# Altium schematic sheet in_buf.SchDoc
size A4
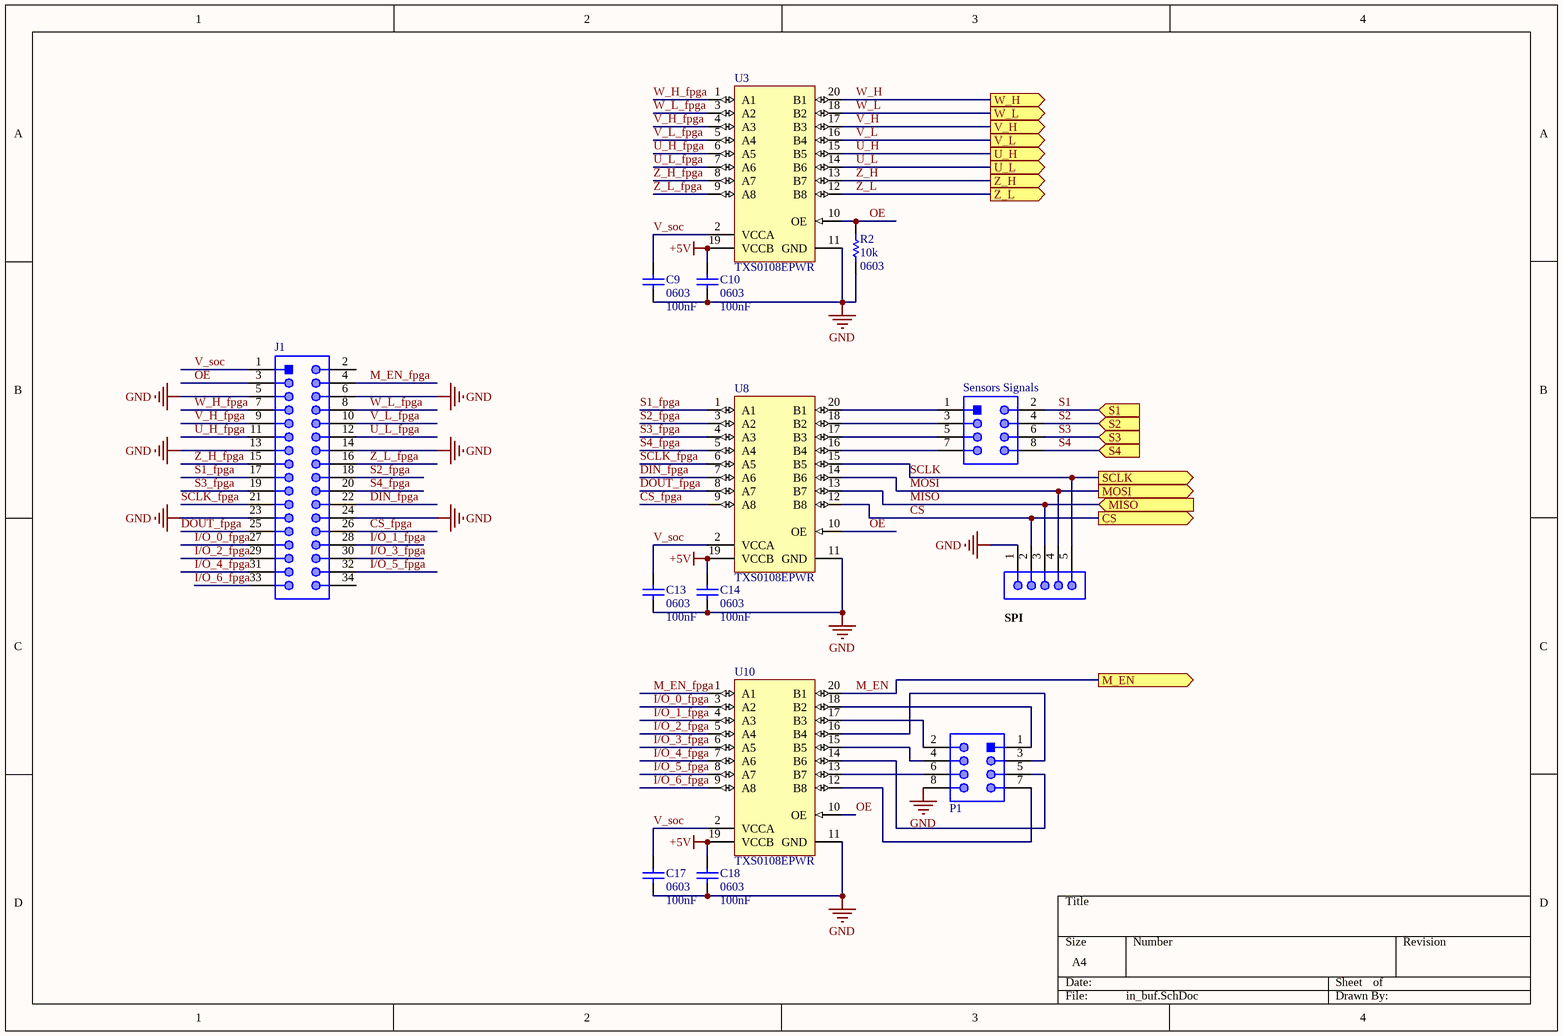
[diagram p0: in_buf.SchDoc]

## Parts
C9  Case Code (Imperial): 0603  Capacitance: 100nF  [CAPC1608X90X35ML10T15]  (hidden comment: GRM188R71H104KA93D)
C10  Case Code (Imperial): 0603  Capacitance: 100nF  [CAPC1608X90X35ML10T15]  (hidden comment: GRM188R71H104KA93D)
C13  Case Code (Imperial): 0603  Capacitance: 100nF  [CAPC1608X90X35ML10T15]  (hidden comment: GRM188R71H104KA93D)
C14  Case Code (Imperial): 0603  Capacitance: 100nF  [CAPC1608X90X35ML10T15]  (hidden comment: GRM188R71H104KA93D)
C17  Case Code (Imperial): 0603  Capacitance: 100nF  [CAPC1608X90X35ML10T15]  (hidden comment: GRM188R71H104KA93D)
C18  Case Code (Imperial): 0603  Capacitance: 100nF  [CAPC1608X90X35ML10T15]  (hidden comment: GRM188R71H104KA93D)
J1  61303421121  [61303421121]  (value not drawn)
P1  61300821121  [61300821121]  (value not drawn)
R2  Resistance (Ohms): 10k  Package Reference: 0603  [RESC1608X55X30ML15T20]  (hidden comment: RMCF0603FT10K0)
Sensors_Signals  61300821121  [61300821121]  (value not drawn)
SPI  PH2541-5-SPGRH-6-3  [PH2541-5-SPGRH-6-3_V]  (value not drawn)
U3  TXS0108EPWR  [PW0020A_M]
U8  TXS0108EPWR  [PW0020A_M]
U10  TXS0108EPWR  [PW0020A_M]

## Ports
CS (out), M_EN (out), MISO (in), MOSI (out), S1 (in), S2 (in), S3 (in), S4 (in), SCLK (out), U_H (out), U_L (out), V_H (out), V_L (out), W_H (out), W_L (out), Z_H (out), Z_L (out)

## Nets
+5V: C10.2 C14.2 C18.2 U3.19(VCCB) U8.19(VCCB) U10.19(VCCB)
GND: C9.1 C10.1 C13.1 C14.1 C17.1 C18.1 J1.5 J1.6 J1.13 J1.14 J1.23 J1.24 P1.8 R2.1 SPI.1 U3.11(GND) U8.11(GND) U10.11(GND)
CS: SPI.2 U8.12(B8) ; port CS
CS_fpga: J1.26 U8.9(A8)
DIN_fpga: J1.22 U8.7(A6)
DOUT_fpga: J1.25 U8.8(A7)
I/O_0_fpga: J1.27 U10.3(A2)
I/O_1_fpga: J1.28 U10.4(A3)
I/O_2_fpga: J1.29 U10.5(A4)
I/O_3_fpga: J1.30 U10.6(A5)
I/O_4_fpga: J1.31 U10.7(A6)
I/O_5_fpga: J1.32 U10.8(A7)
I/O_6_fpga: J1.33 U10.9(A8)
M_EN: U10.20(B1) ; port M_EN
M_EN_fpga: J1.4 U10.1(A1)
MISO: SPI.3 U8.13(B7) ; port MISO
MOSI: SPI.4 U8.14(B6) ; port MOSI
OE: J1.3 R2.2 U3.10(OE) U8.10(OE) U10.10(OE)
S1: Sensors_Signals.2 ; port S1
S1_fpga: J1.17 U8.1(A1)
S2: Sensors_Signals.4 ; port S2
S2_fpga: J1.18 U8.3(A2)
S3: Sensors_Signals.6 ; port S3
S3_fpga: J1.19 U8.4(A3)
S4: Sensors_Signals.8 ; port S4
S4_fpga: J1.20 U8.5(A4)
SCLK: SPI.5 U8.15(B5) ; port SCLK
SCLK_fpga: J1.21 U8.6(A5)
U_H: U3.15(B5) ; port U_H
U_H_fpga: J1.11 U3.6(A5)
U_L: U3.14(B6) ; port U_L
U_L_fpga: J1.12 U3.7(A6)
V_H: U3.17(B3) ; port V_H
V_H_fpga: J1.9 U3.4(A3)
V_L: U3.16(B4) ; port V_L
V_L_fpga: J1.10 U3.5(A4)
V_soc: C9.2 C13.2 C17.2 J1.1 U3.2(VCCA) U8.2(VCCA) U10.2(VCCA)
W_H: U3.20(B1) ; port W_H
W_H_fpga: J1.7 U3.1(A1)
W_L: U3.18(B2) ; port W_L
W_L_fpga: J1.8 U3.3(A2)
Z_H: U3.13(B7) ; port Z_H
Z_H_fpga: J1.15 U3.8(A7)
Z_L: U3.12(B8) ; port Z_L
Z_L_fpga: J1.16 U3.9(A8)
NetP1_1: P1.1 U10.18(B2)
NetP1_2: P1.2 U10.17(B3)
NetP1_3: P1.3 U10.16(B4)
NetP1_4: P1.4 U10.15(B5)
NetP1_5: P1.5 U10.14(B6)
NetP1_6: P1.6 U10.13(B7)
NetP1_7: P1.7 U10.12(B8)
NetSensors_Signals_1: Sensors_Signals.1 U8.20(B1)
NetSensors_Signals_3: Sensors_Signals.3 U8.18(B2)
NetSensors_Signals_5: Sensors_Signals.5 U8.17(B3)
NetSensors_Signals_7: Sensors_Signals.7 U8.16(B4)

Not connected (* = marked no-connect by the designer): J1 2 34

## Library data of the parts
C9 C10 C13 C14 C17 C18 = CMP-2100-03643-1: Chip Capacitor, 0.1 uF, +/- 10%, 50 V, -55 to 125 degC, 0603 (1608 Metric), RoHS, Tape and Reel; Manufacturer: Murata; Dielectric Material: Ceramic; Voltage Rating: 50V; Dielectric: X7R; Insulation Resistance: 10GR; Case Code (Metric): 1608; Lead Free: LeadFree; Depth: 0.8mm; Number of Pins: 2; Radiation Hardening: No; Case/Package: 0603; Manufacturer URL: http://www.murata.com/; Packaging: TapeandReel; Length: 1.6mm; Contact Plating: Tin; Datasheet URL: http://psearch.en.murata.com/capacitor/product/GRM188R71H104KA93%23.pdf; Tolerance: 10%; Min Operating Temperature: -55degC; RoHSCompliant: true; Voltage: 50V; Termination: SMD/SMT; Mount: SurfaceMount; Material: Ceramic; Package Quantity: 1; Height: 0.8mm; Thickness: 0.035inch; REACH SVHC: NoSVHC; Max Operating Temperature: 125degC; Width: 0.8mm; Package Reference: 0603; Voltage Rating (DC): 50V; Datasheet Version: 42675.0; Package Description: 2-Pin Surface Mount Device, Body 1.6 x 0.8 mm
J1 = CMP-1502-01127-1: THT Vertical Pin Header WR-PHD, Pitch 2.54 mm, Dual Row, 34 pins; Manufacturer: Wurth Elektronik; Pitch: 2.54mm; Rated Current: 3A; Withstanding Voltage: 500VAC; Working Voltage: 250VAC; Gender: Male; Pin Number: 34; Contact Resistance: 20mOhm; Operating Temperature: -40to105degC; Part Number: 61303421121; Mounting Technology: THT; Packaging: Bag; Package Reference: 61303421121; Row Number: Dual; Manufacturer URL: http://www.we-online.de; Datasheet URL: https://katalog.we-online.de/em/datasheet/6130xx21121.pdf; Orientation: Vertical; Publisher: WurthElektronik
P1 Sensors_Signals = CMP-1502-01078-1: THT Vertical Pin Header WR-PHD, Pitch 2.54 mm, Dual Row, 8 pins; Manufacturer: Wurth Elektronik; Contact Resistance: 20mOhm; Rated Current: 3A; Working Voltage: 250VAC; Pin Number: 8; Withstanding Voltage: 500VAC; Pitch: 2.54mm; Gender: Male; Datasheet URL: https://katalog.we-online.de/em/datasheet/6130xx21121.pdf; Package Reference: 61300821121; Orientation: Vertical; Part Number: 61300821121; Publisher: WurthElektronik; Mounting Technology: THT; Manufacturer URL: http://www.we-online.de; Packaging: Bag; Row Number: Dual; Operating Temperature: -40to105degC
R2 = CMP-2000-06990-1: Chip Resistor, 10 KOhm, +/- 1%, 0.1 W, -55 to 155 degC, 0603 (1608 Metric), RoHS, Tape and Reel; Manufacturer: Stackpole-Electronics-Inc.; Temperature Coefficient: ±100ppm/°C; Power (Watts): 0.1W,1/10W; Package / Case: 0603(1608Metric); Datasheet Version: 01/2017; Features: AutomotiveAEC-Q200; Packaging: CutTape(CT); Series: RMCF; Tolerance: ±1%; Manufacturer URL: https://www.seielect.com/; Datasheet URL: https://www.seielect.com/Catalog/SEI-RMCF_RMCP.pdf; Supplier Device Package: 0603; Number of Terminations: 2; Family: ChipResistor-SurfaceMount; Mounting Technology: SurfaceMount; Package Description: 2-Pin Surface Mount Device, Body 1.55 x 0.8 mm; Operating Temperature: -55°C~155°C; Composition: ThickFilm; Category: Resistors
SPI = CMP-0261-00002-1: Male Header, Pitch 2.54mm, 5x1 Position, Mated Height 6mm, Tail Length 3mm; PartNumber: PH2541-5-SPGRH-6-3; ComponentLink1URL: http://www.suzhoupinchao.com/; PackageReference: PH2541-5-SPGRH-6-3; Mounting Technology: Through Hole; ComponentLink1Description: Manufacturer URL; PackageDescription: 5-Pin Male Header IDC, 2.54 x 12.7 mm Body, 2.54 mm Pitch
U3 U8 U10 = CMP-2000-04956-1: Bidirectional Voltage-Level Translator for Open-Drain and Push-Pull Application, 8 bit, 1.2 to 3.6 V, -40 to 85 degC, 20-Pin TSSOP, Green (RoHS & no Sb/Br), Tape and Reel; Manufacturer: Texas Instruments; Logic Type: VoltageLevelTranslator; Output Current: 620µA; Propagation Delay: 4.8ns; Supply Voltage Min: 1.2V; No. of Inputs: 8; Supply Voltage Max: 5.5V; SVHC: NoSVHC(16-Jun-2014); No. of Pins: 20; Datasheet URL: https://datasheet.ciiva.com/14287/txs0108e-14287280.pdf; Operating Temperature Min: -40degC; Logic Case Style: TSSOP; Packaging: CutTape; Datasheet Version: Rev. B, 09/2008; MSL: MSL1-Unlimited; Manufacturer URL: http://www.ti.com/; Operating Temperature Max: 85degC